# Altium project pay-optical.PrjPCB (part 2 of 2)
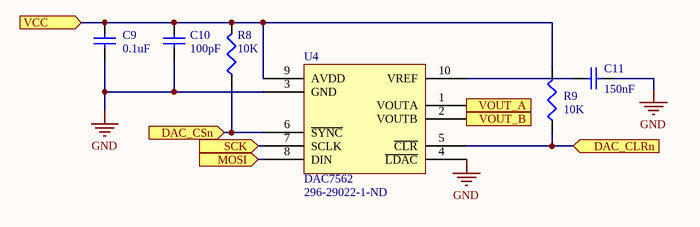
[diagram p13: dac-ic.SchDoc]

## Nets that join several sheets
3V: pay-optical-toplevel (C1.2 U1.1), analog-to-digital-stage (R2.2), adc-ic (7 pins), synchronous-demodulator (C13.2 R11.2 R12.2 U5.5), ADC/Synchronous Demodulator Circuit/CH1/TIA_Signal_Mux (C34_TIA_Signal_Mux1.2 C35_TIA_Signal_Mux1.2 R29_TIA_Signal_Mux1.2 U13_TIA_Signal_Mux1.16), ADC/Synchronous Demodulator Circuit/CH1/TIA1 (C27_TIA1.2 C28_TIA1.2 U10_TIA1.5), ADC/Synchronous Demodulator Circuit/CH1/TIA2 (C27_TIA2.2 C28_TIA2.2 U10_TIA2.5), ADC/Synchronous Demodulator Circuit/CH1/TIA3 (C27_TIA3.2 C28_TIA3.2 U10_TIA3.5), ADC/Synchronous Demodulator Circuit/CH1/TIA4 (C27_TIA4.2 C28_TIA4.2 U10_TIA4.5), ADC/Synchronous Demodulator Circuit/CH1/TIA5 (C27_TIA5.2 C28_TIA5.2 U10_TIA5.5), ADC/Synchronous Demodulator Circuit/CH1/TIA6 (C27_TIA6.2 C28_TIA6.2 U10_TIA6.5), ADC/Synchronous Demodulator Circuit/CH1/TIA7 (C27_TIA7.2 C28_TIA7.2 U10_TIA7.5), ADC/Synchronous Demodulator Circuit/CH1/TIA8 (C27_TIA8.2 C28_TIA8.2 U10_TIA8.5), ADC/Synchronous Demodulator Circuit/CH1/LED_Signal_Mux (C34_LED_Signal_Mux1.2 C35_LED_Signal_Mux1.2 R29_LED_Signal_Mux1.2 U13_LED_Signal_Mux1.16), ADC/Synchronous Demodulator Circuit/CH2/TIA_Signal_Mux (C34_TIA_Signal_Mux2.2 C35_TIA_Signal_Mux2.2 R29_TIA_Signal_Mux2.2 U13_TIA_Signal_Mux2.16), ADC/Synchronous Demodulator Circuit/CH2/TIA1 (C27_TIA9.2 C28_TIA9.2 U10_TIA9.5), ADC/Synchronous Demodulator Circuit/CH2/TIA2 (C27_TIA10.2 C28_TIA10.2 U10_TIA10.5), ADC/Synchronous Demodulator Circuit/CH2/TIA3 (C27_TIA11.2 C28_TIA11.2 U10_TIA11.5), ADC/Synchronous Demodulator Circuit/CH2/TIA4 (C27_TIA12.2 C28_TIA12.2 U10_TIA12.5), ADC/Synchronous Demodulator Circuit/CH2/TIA5 (C27_TIA13.2 C28_TIA13.2 U10_TIA13.5), ADC/Synchronous Demodulator Circuit/CH2/TIA6 (C27_TIA14.2 C28_TIA14.2 U10_TIA14.5), ADC/Synchronous Demodulator Circuit/CH2/TIA7 (C27_TIA15.2 C28_TIA15.2 U10_TIA15.5), ADC/Synchronous Demodulator Circuit/CH2/TIA8 (C27_TIA16.2 C28_TIA16.2 U10_TIA16.5), ADC/Synchronous Demodulator Circuit/CH2/LED_Signal_Mux (C34_LED_Signal_Mux2.2 C35_LED_Signal_Mux2.2 R29_LED_Signal_Mux2.2 U13_LED_Signal_Mux2.16), ADC/Synchronous Demodulator Circuit/CH3/TIA_Signal_Mux (C34_TIA_Signal_Mux3.2 C35_TIA_Signal_Mux3.2 R29_TIA_Signal_Mux3.2 U13_TIA_Signal_Mux3.16), ADC/Synchronous Demodulator Circuit/CH3/TIA1 (C27_TIA17.2 C28_TIA17.2 U10_TIA17.5), ADC/Synchronous Demodulator Circuit/CH3/TIA2 (C27_TIA18.2 C28_TIA18.2 U10_TIA18.5), ADC/Synchronous Demodulator Circuit/CH3/TIA3 (C27_TIA19.2 C28_TIA19.2 U10_TIA19.5), ADC/Synchronous Demodulator Circuit/CH3/TIA4 (C27_TIA20.2 C28_TIA20.2 U10_TIA20.5), ADC/Synchronous Demodulator Circuit/CH3/TIA5 (C27_TIA21.2 C28_TIA21.2 U10_TIA21.5), ADC/Synchronous Demodulator Circuit/CH3/TIA6 (C27_TIA22.2 C28_TIA22.2 U10_TIA22.5), ADC/Synchronous Demodulator Circuit/CH3/TIA7 (C27_TIA23.2 C28_TIA23.2 U10_TIA23.5), ADC/Synchronous Demodulator Circuit/CH3/TIA8 (C27_TIA24.2 C28_TIA24.2 U10_TIA24.5), ADC/Synchronous Demodulator Circuit/CH3/LED_Signal_Mux (C34_LED_Signal_Mux3.2 C35_LED_Signal_Mux3.2 R29_LED_Signal_Mux3.2 U13_LED_Signal_Mux3.16), ADC/Synchronous Demodulator Circuit/SD1 (9 pins), ADC/Synchronous Demodulator Circuit/SD2 (9 pins), ADC/Synchronous Demodulator Circuit/SD3 (9 pins), ADC/Synchronous Demodulator Circuit/SD4 (9 pins), ADC/Synchronous Demodulator Circuit/HP_FILTER1 (5 pins), ADC/Synchronous Demodulator Circuit/HP_FILTER2 (5 pins), ADC/Synchronous Demodulator Circuit/HP_FILTER3 (5 pins), ADC/Synchronous Demodulator Circuit/HP_FILTER4 (5 pins), ADC/Synchronous Demodulator Circuit/CH4/TIA_Signal_Mux (C34_TIA_Signal_Mux4.2 C35_TIA_Signal_Mux4.2 R29_TIA_Signal_Mux4.2 U13_TIA_Signal_Mux4.16), ADC/Synchronous Demodulator Circuit/CH4/TIA1 (C27_TIA25.2 C28_TIA25.2 U10_TIA25.5), ADC/Synchronous Demodulator Circuit/CH4/TIA2 (C27_TIA26.2 C28_TIA26.2 U10_TIA26.5), ADC/Synchronous Demodulator Circuit/CH4/TIA3 (C27_TIA27.2 C28_TIA27.2 U10_TIA27.5), ADC/Synchronous Demodulator Circuit/CH4/TIA4 (C27_TIA28.2 C28_TIA28.2 U10_TIA28.5), ADC/Synchronous Demodulator Circuit/CH4/TIA5 (C27_TIA29.2 C28_TIA29.2 U10_TIA29.5), ADC/Synchronous Demodulator Circuit/CH4/TIA6 (C27_TIA30.2 C28_TIA30.2 U10_TIA30.5), ADC/Synchronous Demodulator Circuit/CH4/TIA7 (C27_TIA31.2 C28_TIA31.2 U10_TIA31.5), ADC/Synchronous Demodulator Circuit/CH4/TIA8 (C27_TIA32.2 C28_TIA32.2 U10_TIA32.5), ADC/Synchronous Demodulator Circuit/CH4/LED_Signal_Mux (C34_LED_Signal_Mux4.2 C35_LED_Signal_Mux4.2 R29_LED_Signal_Mux4.2 U13_LED_Signal_Mux4.16), ADC/Synchronous Demodulator Circuit/CH5/TIA_Signal_Mux (C34_TIA_Signal_Mux5.2 C35_TIA_Signal_Mux5.2 R29_TIA_Signal_Mux5.2 U13_TIA_Signal_Mux5.16), ADC/Synchronous Demodulator Circuit/CH5/TIA_S1 (C27_TIA_S33.2 C28_TIA_S33.2 U10_TIA_S33.5), ADC/Synchronous Demodulator Circuit/CH5/TIA_S2 (C27_TIA_S34.2 C28_TIA_S34.2 U10_TIA_S34.5), ADC/Synchronous Demodulator Circuit/CH5/LED_Signal_Mux (C34_LED_Signal_Mux5.2 C35_LED_Signal_Mux5.2 R29_LED_Signal_Mux5.2 U13_LED_Signal_Mux5.16), sma-amplifier (6 pins), dac-ic (5 pins)
3V3: pay-optical-toplevel (5 pins), adc-ic (C3.2 R6.2 R7.2 U2.24)
AGND: adc-ic (13 pins), ADC/Synchronous Demodulator Circuit/CH1/TIA1 (6 pins), ADC/Synchronous Demodulator Circuit/CH1/TIA2 (6 pins), ADC/Synchronous Demodulator Circuit/CH1/TIA3 (6 pins), ADC/Synchronous Demodulator Circuit/CH1/TIA4 (6 pins), ADC/Synchronous Demodulator Circuit/CH1/TIA5 (6 pins), ADC/Synchronous Demodulator Circuit/CH1/TIA6 (6 pins), ADC/Synchronous Demodulator Circuit/CH1/TIA7 (6 pins), ADC/Synchronous Demodulator Circuit/CH1/TIA8 (6 pins), ADC/Synchronous Demodulator Circuit/CH2/TIA1 (6 pins), ADC/Synchronous Demodulator Circuit/CH2/TIA2 (6 pins), ADC/Synchronous Demodulator Circuit/CH2/TIA3 (6 pins), ADC/Synchronous Demodulator Circuit/CH2/TIA4 (6 pins), ADC/Synchronous Demodulator Circuit/CH2/TIA5 (6 pins), ADC/Synchronous Demodulator Circuit/CH2/TIA6 (6 pins), ADC/Synchronous Demodulator Circuit/CH2/TIA7 (6 pins), ADC/Synchronous Demodulator Circuit/CH2/TIA8 (6 pins), ADC/Synchronous Demodulator Circuit/CH3/TIA1 (6 pins), ADC/Synchronous Demodulator Circuit/CH3/TIA2 (6 pins), ADC/Synchronous Demodulator Circuit/CH3/TIA3 (6 pins), ADC/Synchronous Demodulator Circuit/CH3/TIA4 (6 pins), ADC/Synchronous Demodulator Circuit/CH3/TIA5 (6 pins), ADC/Synchronous Demodulator Circuit/CH3/TIA6 (6 pins), ADC/Synchronous Demodulator Circuit/CH3/TIA7 (6 pins), ADC/Synchronous Demodulator Circuit/CH3/TIA8 (6 pins), ADC/Synchronous Demodulator Circuit/CH4/TIA1 (6 pins), ADC/Synchronous Demodulator Circuit/CH4/TIA2 (6 pins), ADC/Synchronous Demodulator Circuit/CH4/TIA3 (6 pins), ADC/Synchronous Demodulator Circuit/CH4/TIA4 (6 pins), ADC/Synchronous Demodulator Circuit/CH4/TIA5 (6 pins), ADC/Synchronous Demodulator Circuit/CH4/TIA6 (6 pins), ADC/Synchronous Demodulator Circuit/CH4/TIA7 (6 pins), ADC/Synchronous Demodulator Circuit/CH4/TIA8 (6 pins), ADC/Synchronous Demodulator Circuit/CH5/TIA_S1 (6 pins), ADC/Synchronous Demodulator Circuit/CH5/TIA_S2 (6 pins)
GND: pay-optical-toplevel (8 pins), analog-to-digital-stage (R3.1 R4.1 R5.1), synchronous-demodulator (C13.1 U5.2), ADC/Synchronous Demodulator Circuit/CH1/TIA_Signal_Mux (C34_TIA_Signal_Mux1.1 C35_TIA_Signal_Mux1.1 U13_TIA_Signal_Mux1.7 U13_TIA_Signal_Mux1.8), ADC/Synchronous Demodulator Circuit/CH1/LED_Signal_Mux (C34_LED_Signal_Mux1.1 C35_LED_Signal_Mux1.1 U13_LED_Signal_Mux1.7 U13_LED_Signal_Mux1.8), ADC/Synchronous Demodulator Circuit/CH2/TIA_Signal_Mux (C34_TIA_Signal_Mux2.1 C35_TIA_Signal_Mux2.1 U13_TIA_Signal_Mux2.7 U13_TIA_Signal_Mux2.8), ADC/Synchronous Demodulator Circuit/CH2/LED_Signal_Mux (C34_LED_Signal_Mux2.1 C35_LED_Signal_Mux2.1 U13_LED_Signal_Mux2.7 U13_LED_Signal_Mux2.8), ADC/Synchronous Demodulator Circuit/CH3/TIA_Signal_Mux (C34_TIA_Signal_Mux3.1 C35_TIA_Signal_Mux3.1 U13_TIA_Signal_Mux3.7 U13_TIA_Signal_Mux3.8), ADC/Synchronous Demodulator Circuit/CH3/LED_Signal_Mux (C34_LED_Signal_Mux3.1 C35_LED_Signal_Mux3.1 U13_LED_Signal_Mux3.7 U13_LED_Signal_Mux3.8), ADC/Synchronous Demodulator Circuit/SD1 (9 pins), ADC/Synchronous Demodulator Circuit/SD2 (9 pins), ADC/Synchronous Demodulator Circuit/SD3 (9 pins), ADC/Synchronous Demodulator Circuit/SD4 (9 pins), ADC/Synchronous Demodulator Circuit/HP_FILTER1 (8 pins), ADC/Synchronous Demodulator Circuit/HP_FILTER2 (8 pins), ADC/Synchronous Demodulator Circuit/HP_FILTER3 (8 pins), ADC/Synchronous Demodulator Circuit/HP_FILTER4 (8 pins), ADC/Synchronous Demodulator Circuit/CH4/TIA_Signal_Mux (C34_TIA_Signal_Mux4.1 C35_TIA_Signal_Mux4.1 U13_TIA_Signal_Mux4.7 U13_TIA_Signal_Mux4.8), ADC/Synchronous Demodulator Circuit/CH4/LED_Signal_Mux (C34_LED_Signal_Mux4.1 C35_LED_Signal_Mux4.1 U13_LED_Signal_Mux4.7 U13_LED_Signal_Mux4.8), special-channel-selection (R20.1 R21.1), ADC/Synchronous Demodulator Circuit/CH5/TIA_Signal_Mux (C34_TIA_Signal_Mux5.1 C35_TIA_Signal_Mux5.1 U13_TIA_Signal_Mux5.7 U13_TIA_Signal_Mux5.8), ADC/Synchronous Demodulator Circuit/CH5/LED_Signal_Mux (C34_LED_Signal_Mux5.1 C35_LED_Signal_Mux5.1 U13_LED_Signal_Mux5.7 U13_LED_Signal_Mux5.8), sma-amplifier (17 pins), ADC/LPF_P1 (C12_LPF_P5.1), ADC/LPF_P2 (C12_LPF_P6.1), ADC/LPF_P3 (C12_LPF_P7.1), ADC/LPF_P4 (C12_LPF_P8.1), dac-ic (5 pins), ADC/LPF_N1 (C12_LPF_N1.1), ADC/LPF_N2 (C12_LPF_N2.1), ADC/LPF_N3 (C12_LPF_N3.1), ADC/LPF_N4 (C12_LPF_N4.1)
ADC_CSn: pay-optical-toplevel (P1.14), adc-ic (R6.1 U2.32)
ADC_SYNCn: pay-optical-toplevel (P1.16), adc-ic (R7.1 U2.25)
AIN1/P3: analog-to-digital-stage (R2.1), adc-ic (U2.1), synchronous-demodulator (U5.4), ADC/Synchronous Demodulator Circuit/CH1/TIA_Signal_Mux (R29_TIA_Signal_Mux1.1 U13_TIA_Signal_Mux1.6), ADC/Synchronous Demodulator Circuit/CH1/LED_Signal_Mux (R29_LED_Signal_Mux1.1 U13_LED_Signal_Mux1.6), ADC/Synchronous Demodulator Circuit/CH2/TIA_Signal_Mux (R29_TIA_Signal_Mux2.1 U13_TIA_Signal_Mux2.6), ADC/Synchronous Demodulator Circuit/CH2/LED_Signal_Mux (R29_LED_Signal_Mux2.1 U13_LED_Signal_Mux2.6), ADC/Synchronous Demodulator Circuit/CH3/TIA_Signal_Mux (R29_TIA_Signal_Mux3.1 U13_TIA_Signal_Mux3.6), ADC/Synchronous Demodulator Circuit/CH3/LED_Signal_Mux (R29_LED_Signal_Mux3.1 U13_LED_Signal_Mux3.6)
AIN2/P2: analog-to-digital-stage (R3.2), adc-ic (U2.2), ADC/Synchronous Demodulator Circuit/CH1/TIA_Signal_Mux (U13_TIA_Signal_Mux1.9), ADC/Synchronous Demodulator Circuit/CH1/LED_Signal_Mux (U13_LED_Signal_Mux1.9), ADC/Synchronous Demodulator Circuit/CH2/TIA_Signal_Mux (U13_TIA_Signal_Mux2.9), ADC/Synchronous Demodulator Circuit/CH2/LED_Signal_Mux (U13_LED_Signal_Mux2.9), ADC/Synchronous Demodulator Circuit/CH3/TIA_Signal_Mux (U13_TIA_Signal_Mux3.9), ADC/Synchronous Demodulator Circuit/CH3/LED_Signal_Mux (U13_LED_Signal_Mux3.9), ADC/Synchronous Demodulator Circuit/CH4/TIA_Signal_Mux (U13_TIA_Signal_Mux4.9), ADC/Synchronous Demodulator Circuit/CH4/LED_Signal_Mux (U13_LED_Signal_Mux4.9), ADC/Synchronous Demodulator Circuit/CH5/TIA_Signal_Mux (U13_TIA_Signal_Mux5.9), ADC/Synchronous Demodulator Circuit/CH5/LED_Signal_Mux (U13_LED_Signal_Mux5.9)
AIN3/P1: analog-to-digital-stage (R4.2), adc-ic (U2.3), ADC/Synchronous Demodulator Circuit/CH1/TIA_Signal_Mux (U13_TIA_Signal_Mux1.10), ADC/Synchronous Demodulator Circuit/CH1/LED_Signal_Mux (U13_LED_Signal_Mux1.10), ADC/Synchronous Demodulator Circuit/CH2/TIA_Signal_Mux (U13_TIA_Signal_Mux2.10), ADC/Synchronous Demodulator Circuit/CH2/LED_Signal_Mux (U13_LED_Signal_Mux2.10), ADC/Synchronous Demodulator Circuit/CH3/TIA_Signal_Mux (U13_TIA_Signal_Mux3.10), ADC/Synchronous Demodulator Circuit/CH3/LED_Signal_Mux (U13_LED_Signal_Mux3.10), ADC/Synchronous Demodulator Circuit/CH4/TIA_Signal_Mux (U13_TIA_Signal_Mux4.10), ADC/Synchronous Demodulator Circuit/CH4/LED_Signal_Mux (U13_LED_Signal_Mux4.10), ADC/Synchronous Demodulator Circuit/CH5/TIA_Signal_Mux (U13_TIA_Signal_Mux5.10), ADC/Synchronous Demodulator Circuit/CH5/LED_Signal_Mux (U13_LED_Signal_Mux5.10)
AIN4/P0: analog-to-digital-stage (R5.2), adc-ic (U2.4), ADC/Synchronous Demodulator Circuit/CH1/TIA_Signal_Mux (U13_TIA_Signal_Mux1.11), ADC/Synchronous Demodulator Circuit/CH1/LED_Signal_Mux (U13_LED_Signal_Mux1.11), ADC/Synchronous Demodulator Circuit/CH2/TIA_Signal_Mux (U13_TIA_Signal_Mux2.11), ADC/Synchronous Demodulator Circuit/CH2/LED_Signal_Mux (U13_LED_Signal_Mux2.11), ADC/Synchronous Demodulator Circuit/CH3/TIA_Signal_Mux (U13_TIA_Signal_Mux3.11), ADC/Synchronous Demodulator Circuit/CH3/LED_Signal_Mux (U13_LED_Signal_Mux3.11), ADC/Synchronous Demodulator Circuit/CH4/TIA_Signal_Mux (U13_TIA_Signal_Mux4.11), ADC/Synchronous Demodulator Circuit/CH4/LED_Signal_Mux (U13_LED_Signal_Mux4.11), ADC/Synchronous Demodulator Circuit/CH5/TIA_Signal_Mux (U13_TIA_Signal_Mux5.11), ADC/Synchronous Demodulator Circuit/CH5/LED_Signal_Mux (U13_LED_Signal_Mux5.11)
AIN15: adc-ic (U2.19), dac-ic (U4.1)
AIN16: adc-ic (U2.20), dac-ic (U4.2)
CH4_ENn: synchronous-demodulator (R11.1 U5.1), ADC/Synchronous Demodulator Circuit/CH4/TIA_Signal_Mux (R29_TIA_Signal_Mux4.1 U13_TIA_Signal_Mux4.6), ADC/Synchronous Demodulator Circuit/CH4/LED_Signal_Mux (R29_LED_Signal_Mux4.1 U13_LED_Signal_Mux4.6)
DAC_CSn: pay-optical-toplevel (P1.12), dac-ic (R8.1 U4.6)
FL_LED1_CH1: ADC/Synchronous Demodulator Circuit/CH1/TIA1 (R22_TIA1.1), ADC/Synchronous Demodulator Circuit/CH1/LED_Signal_Mux (U13_LED_Signal_Mux1.13)
FL_LED1_CH2: ADC/Synchronous Demodulator Circuit/CH2/TIA1 (R22_TIA9.1), ADC/Synchronous Demodulator Circuit/CH2/LED_Signal_Mux (U13_LED_Signal_Mux2.13)
FL_LED1_CH3: ADC/Synchronous Demodulator Circuit/CH3/TIA1 (R22_TIA17.1), ADC/Synchronous Demodulator Circuit/CH3/LED_Signal_Mux (U13_LED_Signal_Mux3.13)
FL_LED1_CH4: ADC/Synchronous Demodulator Circuit/CH4/TIA1 (R22_TIA25.1), ADC/Synchronous Demodulator Circuit/CH4/LED_Signal_Mux (U13_LED_Signal_Mux4.13)
FL_LED2_CH1: ADC/Synchronous Demodulator Circuit/CH1/TIA2 (R22_TIA2.1), ADC/Synchronous Demodulator Circuit/CH1/LED_Signal_Mux (U13_LED_Signal_Mux1.14)
FL_LED2_CH2: ADC/Synchronous Demodulator Circuit/CH2/TIA2 (R22_TIA10.1), ADC/Synchronous Demodulator Circuit/CH2/LED_Signal_Mux (U13_LED_Signal_Mux2.14)
FL_LED2_CH3: ADC/Synchronous Demodulator Circuit/CH3/TIA2 (R22_TIA18.1), ADC/Synchronous Demodulator Circuit/CH3/LED_Signal_Mux (U13_LED_Signal_Mux3.14)
FL_LED2_CH4: ADC/Synchronous Demodulator Circuit/CH4/TIA2 (R22_TIA26.1), ADC/Synchronous Demodulator Circuit/CH4/LED_Signal_Mux (U13_LED_Signal_Mux4.14)
FL_LED3_CH1: ADC/Synchronous Demodulator Circuit/CH1/TIA3 (R22_TIA3.1), ADC/Synchronous Demodulator Circuit/CH1/LED_Signal_Mux (U13_LED_Signal_Mux1.15)
FL_LED3_CH2: ADC/Synchronous Demodulator Circuit/CH2/TIA3 (R22_TIA11.1), ADC/Synchronous Demodulator Circuit/CH2/LED_Signal_Mux (U13_LED_Signal_Mux2.15)
FL_LED3_CH3: ADC/Synchronous Demodulator Circuit/CH3/TIA3 (R22_TIA19.1), ADC/Synchronous Demodulator Circuit/CH3/LED_Signal_Mux (U13_LED_Signal_Mux3.15)
FL_LED3_CH4: ADC/Synchronous Demodulator Circuit/CH4/TIA3 (R22_TIA27.1), ADC/Synchronous Demodulator Circuit/CH4/LED_Signal_Mux (U13_LED_Signal_Mux4.15)
FL_LED4_CH1: ADC/Synchronous Demodulator Circuit/CH1/TIA4 (R22_TIA4.1), ADC/Synchronous Demodulator Circuit/CH1/LED_Signal_Mux (U13_LED_Signal_Mux1.12)
FL_LED4_CH2: ADC/Synchronous Demodulator Circuit/CH2/TIA4 (R22_TIA12.1), ADC/Synchronous Demodulator Circuit/CH2/LED_Signal_Mux (U13_LED_Signal_Mux2.12)
FL_LED4_CH3: ADC/Synchronous Demodulator Circuit/CH3/TIA4 (R22_TIA20.1), ADC/Synchronous Demodulator Circuit/CH3/LED_Signal_Mux (U13_LED_Signal_Mux3.12)
FL_LED4_CH4: ADC/Synchronous Demodulator Circuit/CH4/TIA4 (R22_TIA28.1), ADC/Synchronous Demodulator Circuit/CH4/LED_Signal_Mux (U13_LED_Signal_Mux4.12)
FL_LED5_CH1: ADC/Synchronous Demodulator Circuit/CH1/TIA5 (R22_TIA5.1), ADC/Synchronous Demodulator Circuit/CH1/LED_Signal_Mux (U13_LED_Signal_Mux1.1)
FL_LED5_CH2: ADC/Synchronous Demodulator Circuit/CH2/TIA5 (R22_TIA13.1), ADC/Synchronous Demodulator Circuit/CH2/LED_Signal_Mux (U13_LED_Signal_Mux2.1)
FL_LED5_CH3: ADC/Synchronous Demodulator Circuit/CH3/TIA5 (R22_TIA21.1), ADC/Synchronous Demodulator Circuit/CH3/LED_Signal_Mux (U13_LED_Signal_Mux3.1)
FL_LED5_CH4: ADC/Synchronous Demodulator Circuit/CH4/TIA5 (R22_TIA29.1), ADC/Synchronous Demodulator Circuit/CH4/LED_Signal_Mux (U13_LED_Signal_Mux4.1)
FL_LED6_CH1: ADC/Synchronous Demodulator Circuit/CH1/TIA6 (R22_TIA6.1), ADC/Synchronous Demodulator Circuit/CH1/LED_Signal_Mux (U13_LED_Signal_Mux1.5)
FL_LED6_CH2: ADC/Synchronous Demodulator Circuit/CH2/TIA6 (R22_TIA14.1), ADC/Synchronous Demodulator Circuit/CH2/LED_Signal_Mux (U13_LED_Signal_Mux2.5)
FL_LED6_CH3: ADC/Synchronous Demodulator Circuit/CH3/TIA6 (R22_TIA22.1), ADC/Synchronous Demodulator Circuit/CH3/LED_Signal_Mux (U13_LED_Signal_Mux3.5)
FL_LED6_CH4: ADC/Synchronous Demodulator Circuit/CH4/TIA6 (R22_TIA30.1), ADC/Synchronous Demodulator Circuit/CH4/LED_Signal_Mux (U13_LED_Signal_Mux4.5)
FL_LED7_CH1: ADC/Synchronous Demodulator Circuit/CH1/TIA7 (R22_TIA7.1), ADC/Synchronous Demodulator Circuit/CH1/LED_Signal_Mux (U13_LED_Signal_Mux1.2)
FL_LED7_CH2: ADC/Synchronous Demodulator Circuit/CH2/TIA7 (R22_TIA15.1), ADC/Synchronous Demodulator Circuit/CH2/LED_Signal_Mux (U13_LED_Signal_Mux2.2)
FL_LED7_CH3: ADC/Synchronous Demodulator Circuit/CH3/TIA7 (R22_TIA23.1), ADC/Synchronous Demodulator Circuit/CH3/LED_Signal_Mux (U13_LED_Signal_Mux3.2)
FL_LED7_CH4: ADC/Synchronous Demodulator Circuit/CH4/TIA7 (R22_TIA31.1), ADC/Synchronous Demodulator Circuit/CH4/LED_Signal_Mux (U13_LED_Signal_Mux4.2)
FL_LED8_CH1: ADC/Synchronous Demodulator Circuit/CH1/TIA8 (R22_TIA8.1), ADC/Synchronous Demodulator Circuit/CH1/LED_Signal_Mux (U13_LED_Signal_Mux1.4)
FL_LED8_CH2: ADC/Synchronous Demodulator Circuit/CH2/TIA8 (R22_TIA16.1), ADC/Synchronous Demodulator Circuit/CH2/LED_Signal_Mux (U13_LED_Signal_Mux2.4)
FL_LED8_CH3: ADC/Synchronous Demodulator Circuit/CH3/TIA8 (R22_TIA24.1), ADC/Synchronous Demodulator Circuit/CH3/LED_Signal_Mux (U13_LED_Signal_Mux3.4)
FL_LED8_CH4: ADC/Synchronous Demodulator Circuit/CH4/TIA8 (R22_TIA32.1), ADC/Synchronous Demodulator Circuit/CH4/LED_Signal_Mux (U13_LED_Signal_Mux4.4)
LED_Sig1: ADC/Synchronous Demodulator Circuit/CH1/LED_Signal_Mux (U13_LED_Signal_Mux1.3), ADC/Synchronous Demodulator Circuit/SD1 (U6_SD1.1 U6_SD1.4)
LED_Sig2: ADC/Synchronous Demodulator Circuit/CH2/LED_Signal_Mux (U13_LED_Signal_Mux2.3), ADC/Synchronous Demodulator Circuit/SD2 (U6_SD2.1 U6_SD2.4)
LED_Sig3: ADC/Synchronous Demodulator Circuit/CH3/LED_Signal_Mux (U13_LED_Signal_Mux3.3), ADC/Synchronous Demodulator Circuit/SD3 (U6_SD3.1 U6_SD3.4)
LED_Sig4: ADC/Synchronous Demodulator Circuit/SD4 (U6_SD4.1 U6_SD4.4), ADC/Synchronous Demodulator Circuit/CH4/LED_Signal_Mux (U13_LED_Signal_Mux4.3), ADC/Synchronous Demodulator Circuit/CH5/LED_Signal_Mux (U13_LED_Signal_Mux5.3)
LPF_N1: adc-ic (U2.8), ADC/LPF_N1 (C12_LPF_N1.2 R10_LPF_N1.2)
LPF_N2: adc-ic (U2.10), ADC/LPF_N2 (C12_LPF_N2.2 R10_LPF_N2.2)
LPF_N3: adc-ic (U2.12), ADC/LPF_N3 (C12_LPF_N3.2 R10_LPF_N3.2)
LPF_N4: adc-ic (U2.14), ADC/LPF_N4 (C12_LPF_N4.2 R10_LPF_N4.2)
LPF_P1: adc-ic (U2.7), ADC/LPF_P1 (C12_LPF_P5.2 R10_LPF_P5.2)
LPF_P2: adc-ic (U2.9), ADC/LPF_P2 (C12_LPF_P6.2 R10_LPF_P6.2)
LPF_P3: adc-ic (U2.11), ADC/LPF_P3 (C12_LPF_P7.2 R10_LPF_P7.2)
LPF_P4: adc-ic (U2.13), ADC/LPF_P4 (C12_LPF_P8.2 R10_LPF_P8.2)
MISO: pay-optical-toplevel (P1.4), adc-ic (U2.27)
MOSI: pay-optical-toplevel (P1.6), adc-ic (U2.28), ADC/Synchronous Demodulator Circuit/SD1 (U7_SD1.14), ADC/Synchronous Demodulator Circuit/SD2 (U7_SD2.14), ADC/Synchronous Demodulator Circuit/SD3 (U7_SD3.14), ADC/Synchronous Demodulator Circuit/SD4 (U7_SD4.14), dac-ic (U4.8)
MUX_5_EN: pay-optical-toplevel (P1.10), synchronous-demodulator (R12.1 U5.3), ADC/Synchronous Demodulator Circuit/CH5/TIA_Signal_Mux (R29_TIA_Signal_Mux5.1 U13_TIA_Signal_Mux5.6), ADC/Synchronous Demodulator Circuit/CH5/LED_Signal_Mux (R29_LED_Signal_Mux5.1 U13_LED_Signal_Mux5.6)
REFSigO1: ADC/Synchronous Demodulator Circuit/SD1 (C20_SD1.2 U7_SD1.7 U7_SD1.8), ADC/Synchronous Demodulator Circuit/HP_FILTER1 (U8_HP_FILTER1.3)
REFSigO2: ADC/Synchronous Demodulator Circuit/SD2 (C20_SD2.2 U7_SD2.7 U7_SD2.8), ADC/Synchronous Demodulator Circuit/HP_FILTER2 (U8_HP_FILTER2.3)
REFSigO3: ADC/Synchronous Demodulator Circuit/SD3 (C20_SD3.2 U7_SD3.7 U7_SD3.8), ADC/Synchronous Demodulator Circuit/HP_FILTER3 (U8_HP_FILTER3.3)
REFSigO4: ADC/Synchronous Demodulator Circuit/SD4 (C20_SD4.2 U7_SD4.7 U7_SD4.8), ADC/Synchronous Demodulator Circuit/HP_FILTER4 (U8_HP_FILTER4.3)
S3: special-channel-selection (R21.2), ADC/Synchronous Demodulator Circuit/CH5/TIA_Signal_Mux (6 pins)
S3: ADC/Synchronous Demodulator Circuit/CH5/LED_Signal_Mux (U13_LED_Signal_Mux5.15), sma-amplifier (U11.1 U11.4)
S4: ADC/Synchronous Demodulator Circuit/CH5/LED_Signal_Mux (U13_LED_Signal_Mux5.12), sma-amplifier (C29.1 R25.2 U12.1)
S5: special-channel-selection (R20.2), ADC/Synchronous Demodulator Circuit/CH5/LED_Signal_Mux (U13_LED_Signal_Mux5.1 U13_LED_Signal_Mux5.2 U13_LED_Signal_Mux5.4 U13_LED_Signal_Mux5.5)
S_FL_LED1: ADC/Synchronous Demodulator Circuit/CH5/TIA_S1 (R22_TIA_S33.1), ADC/Synchronous Demodulator Circuit/CH5/LED_Signal_Mux (U13_LED_Signal_Mux5.13)
S_FL_LED2: ADC/Synchronous Demodulator Circuit/CH5/TIA_S2 (R22_TIA_S34.1), ADC/Synchronous Demodulator Circuit/CH5/LED_Signal_Mux (U13_LED_Signal_Mux5.14)
S_TIA1: ADC/Synchronous Demodulator Circuit/CH5/TIA_Signal_Mux (U13_TIA_Signal_Mux5.13), ADC/Synchronous Demodulator Circuit/CH5/TIA_S1 (C26_TIA_S33.2 R23_TIA_S33.2 U10_TIA_S33.1)
S_TIA2: ADC/Synchronous Demodulator Circuit/CH5/TIA_Signal_Mux (U13_TIA_Signal_Mux5.14), ADC/Synchronous Demodulator Circuit/CH5/TIA_S2 (C26_TIA_S34.2 R23_TIA_S34.2 U10_TIA_S34.1)
SCK: pay-optical-toplevel (P1.8), adc-ic (U2.31), ADC/Synchronous Demodulator Circuit/SD1 (U7_SD1.15), ADC/Synchronous Demodulator Circuit/SD2 (U7_SD2.15), ADC/Synchronous Demodulator Circuit/SD3 (U7_SD3.15), ADC/Synchronous Demodulator Circuit/SD4 (U7_SD4.15), dac-ic (U4.7)
SD_CLKIN: pay-optical-toplevel (P1.18), ADC/Synchronous Demodulator Circuit/SD1 (R13_SD1.2), ADC/Synchronous Demodulator Circuit/SD2 (R13_SD2.2), ADC/Synchronous Demodulator Circuit/SD3 (R13_SD3.2), ADC/Synchronous Demodulator Circuit/SD4 (R13_SD4.2)
SD_CSn1: pay-optical-toplevel (P1.9), ADC/Synchronous Demodulator Circuit/SD1 (R14_SD1.2 U7_SD1.3)
SD_CSn2: pay-optical-toplevel (P1.7), ADC/Synchronous Demodulator Circuit/SD2 (R14_SD2.2 U7_SD2.3)
SD_CSn3: pay-optical-toplevel (P1.5), ADC/Synchronous Demodulator Circuit/SD3 (R14_SD3.2 U7_SD3.3)
SD_CSn4: pay-optical-toplevel (P1.3), ADC/Synchronous Demodulator Circuit/SD4 (R14_SD4.2 U7_SD4.3)
SDOutN1: ADC/Synchronous Demodulator Circuit/SD1 (U7_SD1.10), ADC/LPF_N1 (R10_LPF_N1.1)
SDOutN2: ADC/Synchronous Demodulator Circuit/SD2 (U7_SD2.10), ADC/LPF_N2 (R10_LPF_N2.1)
SDOutN3: ADC/Synchronous Demodulator Circuit/SD3 (U7_SD3.10), ADC/LPF_N3 (R10_LPF_N3.1)
SDOutN4: ADC/Synchronous Demodulator Circuit/SD4 (U7_SD4.10), ADC/LPF_N4 (R10_LPF_N4.1)
SDOutP1: ADC/Synchronous Demodulator Circuit/SD1 (U7_SD1.11), ADC/LPF_P1 (R10_LPF_P5.1)
SDOutP2: ADC/Synchronous Demodulator Circuit/SD2 (U7_SD2.11), ADC/LPF_P2 (R10_LPF_P6.1)
SDOutP3: ADC/Synchronous Demodulator Circuit/SD3 (U7_SD3.11), ADC/LPF_P3 (R10_LPF_P7.1)
SDOutP4: ADC/Synchronous Demodulator Circuit/SD4 (U7_SD4.11), ADC/LPF_P4 (R10_LPF_P8.1)
SDSigIn1: ADC/Synchronous Demodulator Circuit/SD1 (U7_SD1.6), ADC/Synchronous Demodulator Circuit/HP_FILTER1 (C25_HP_FILTER1.2 R19_HP_FILTER1.2)
SDSigIn2: ADC/Synchronous Demodulator Circuit/SD2 (U7_SD2.6), ADC/Synchronous Demodulator Circuit/HP_FILTER2 (C25_HP_FILTER2.2 R19_HP_FILTER2.2)
SDSigIn3: ADC/Synchronous Demodulator Circuit/SD3 (U7_SD3.6), ADC/Synchronous Demodulator Circuit/HP_FILTER3 (C25_HP_FILTER3.2 R19_HP_FILTER3.2)
SDSigIn4: ADC/Synchronous Demodulator Circuit/SD4 (U7_SD4.6), ADC/Synchronous Demodulator Circuit/HP_FILTER4 (C25_HP_FILTER4.2 R19_HP_FILTER4.2)
SYNCO1: pay-optical-toplevel (P1.17), ADC/Synchronous Demodulator Circuit/SD1 (U7_SD1.2)
SYNCO2: pay-optical-toplevel (P1.15), ADC/Synchronous Demodulator Circuit/SD2 (U7_SD2.2)
SYNCO3: pay-optical-toplevel (P1.13), ADC/Synchronous Demodulator Circuit/SD3 (U7_SD3.2)
SYNCO4: pay-optical-toplevel (P1.11), ADC/Synchronous Demodulator Circuit/SD4 (U7_SD4.2)
TIA1_CH1: ADC/Synchronous Demodulator Circuit/CH1/TIA_Signal_Mux (U13_TIA_Signal_Mux1.13), ADC/Synchronous Demodulator Circuit/CH1/TIA1 (C26_TIA1.2 R23_TIA1.2 U10_TIA1.1)
TIA1_CH2: ADC/Synchronous Demodulator Circuit/CH2/TIA_Signal_Mux (U13_TIA_Signal_Mux2.13), ADC/Synchronous Demodulator Circuit/CH2/TIA1 (C26_TIA9.2 R23_TIA9.2 U10_TIA9.1)
TIA1_CH3: ADC/Synchronous Demodulator Circuit/CH3/TIA_Signal_Mux (U13_TIA_Signal_Mux3.13), ADC/Synchronous Demodulator Circuit/CH3/TIA1 (C26_TIA17.2 R23_TIA17.2 U10_TIA17.1)
TIA1_CH4: ADC/Synchronous Demodulator Circuit/CH4/TIA_Signal_Mux (U13_TIA_Signal_Mux4.13), ADC/Synchronous Demodulator Circuit/CH4/TIA1 (C26_TIA25.2 R23_TIA25.2 U10_TIA25.1)
TIA2_CH1: ADC/Synchronous Demodulator Circuit/CH1/TIA_Signal_Mux (U13_TIA_Signal_Mux1.14), ADC/Synchronous Demodulator Circuit/CH1/TIA2 (C26_TIA2.2 R23_TIA2.2 U10_TIA2.1)
TIA2_CH2: ADC/Synchronous Demodulator Circuit/CH2/TIA_Signal_Mux (U13_TIA_Signal_Mux2.14), ADC/Synchronous Demodulator Circuit/CH2/TIA2 (C26_TIA10.2 R23_TIA10.2 U10_TIA10.1)
TIA2_CH3: ADC/Synchronous Demodulator Circuit/CH3/TIA_Signal_Mux (U13_TIA_Signal_Mux3.14), ADC/Synchronous Demodulator Circuit/CH3/TIA2 (C26_TIA18.2 R23_TIA18.2 U10_TIA18.1)
TIA2_CH4: ADC/Synchronous Demodulator Circuit/CH4/TIA_Signal_Mux (U13_TIA_Signal_Mux4.14), ADC/Synchronous Demodulator Circuit/CH4/TIA2 (C26_TIA26.2 R23_TIA26.2 U10_TIA26.1)
TIA3_CH1: ADC/Synchronous Demodulator Circuit/CH1/TIA_Signal_Mux (U13_TIA_Signal_Mux1.15), ADC/Synchronous Demodulator Circuit/CH1/TIA3 (C26_TIA3.2 R23_TIA3.2 U10_TIA3.1)
TIA3_CH2: ADC/Synchronous Demodulator Circuit/CH2/TIA_Signal_Mux (U13_TIA_Signal_Mux2.15), ADC/Synchronous Demodulator Circuit/CH2/TIA3 (C26_TIA11.2 R23_TIA11.2 U10_TIA11.1)
TIA3_CH3: ADC/Synchronous Demodulator Circuit/CH3/TIA_Signal_Mux (U13_TIA_Signal_Mux3.15), ADC/Synchronous Demodulator Circuit/CH3/TIA3 (C26_TIA19.2 R23_TIA19.2 U10_TIA19.1)
TIA3_CH4: ADC/Synchronous Demodulator Circuit/CH4/TIA_Signal_Mux (U13_TIA_Signal_Mux4.15), ADC/Synchronous Demodulator Circuit/CH4/TIA3 (C26_TIA27.2 R23_TIA27.2 U10_TIA27.1)
TIA4_CH1: ADC/Synchronous Demodulator Circuit/CH1/TIA_Signal_Mux (U13_TIA_Signal_Mux1.12), ADC/Synchronous Demodulator Circuit/CH1/TIA4 (C26_TIA4.2 R23_TIA4.2 U10_TIA4.1)
TIA4_CH2: ADC/Synchronous Demodulator Circuit/CH2/TIA_Signal_Mux (U13_TIA_Signal_Mux2.12), ADC/Synchronous Demodulator Circuit/CH2/TIA4 (C26_TIA12.2 R23_TIA12.2 U10_TIA12.1)
TIA4_CH3: ADC/Synchronous Demodulator Circuit/CH3/TIA_Signal_Mux (U13_TIA_Signal_Mux3.12), ADC/Synchronous Demodulator Circuit/CH3/TIA4 (C26_TIA20.2 R23_TIA20.2 U10_TIA20.1)
TIA4_CH4: ADC/Synchronous Demodulator Circuit/CH4/TIA_Signal_Mux (U13_TIA_Signal_Mux4.12), ADC/Synchronous Demodulator Circuit/CH4/TIA4 (C26_TIA28.2 R23_TIA28.2 U10_TIA28.1)
TIA5_CH1: ADC/Synchronous Demodulator Circuit/CH1/TIA_Signal_Mux (U13_TIA_Signal_Mux1.1), ADC/Synchronous Demodulator Circuit/CH1/TIA5 (C26_TIA5.2 R23_TIA5.2 U10_TIA5.1)
TIA5_CH2: ADC/Synchronous Demodulator Circuit/CH2/TIA_Signal_Mux (U13_TIA_Signal_Mux2.1), ADC/Synchronous Demodulator Circuit/CH2/TIA5 (C26_TIA13.2 R23_TIA13.2 U10_TIA13.1)
TIA5_CH3: ADC/Synchronous Demodulator Circuit/CH3/TIA_Signal_Mux (U13_TIA_Signal_Mux3.1), ADC/Synchronous Demodulator Circuit/CH3/TIA5 (C26_TIA21.2 R23_TIA21.2 U10_TIA21.1)
TIA5_CH4: ADC/Synchronous Demodulator Circuit/CH4/TIA_Signal_Mux (U13_TIA_Signal_Mux4.1), ADC/Synchronous Demodulator Circuit/CH4/TIA5 (C26_TIA29.2 R23_TIA29.2 U10_TIA29.1)
TIA6_CH1: ADC/Synchronous Demodulator Circuit/CH1/TIA_Signal_Mux (U13_TIA_Signal_Mux1.5), ADC/Synchronous Demodulator Circuit/CH1/TIA6 (C26_TIA6.2 R23_TIA6.2 U10_TIA6.1)
TIA6_CH2: ADC/Synchronous Demodulator Circuit/CH2/TIA_Signal_Mux (U13_TIA_Signal_Mux2.5), ADC/Synchronous Demodulator Circuit/CH2/TIA6 (C26_TIA14.2 R23_TIA14.2 U10_TIA14.1)
TIA6_CH3: ADC/Synchronous Demodulator Circuit/CH3/TIA_Signal_Mux (U13_TIA_Signal_Mux3.5), ADC/Synchronous Demodulator Circuit/CH3/TIA6 (C26_TIA22.2 R23_TIA22.2 U10_TIA22.1)
TIA6_CH4: ADC/Synchronous Demodulator Circuit/CH4/TIA_Signal_Mux (U13_TIA_Signal_Mux4.5), ADC/Synchronous Demodulator Circuit/CH4/TIA6 (C26_TIA30.2 R23_TIA30.2 U10_TIA30.1)
TIA7_CH1: ADC/Synchronous Demodulator Circuit/CH1/TIA_Signal_Mux (U13_TIA_Signal_Mux1.2), ADC/Synchronous Demodulator Circuit/CH1/TIA7 (C26_TIA7.2 R23_TIA7.2 U10_TIA7.1)
TIA7_CH2: ADC/Synchronous Demodulator Circuit/CH2/TIA_Signal_Mux (U13_TIA_Signal_Mux2.2), ADC/Synchronous Demodulator Circuit/CH2/TIA7 (C26_TIA15.2 R23_TIA15.2 U10_TIA15.1)
TIA7_CH3: ADC/Synchronous Demodulator Circuit/CH3/TIA_Signal_Mux (U13_TIA_Signal_Mux3.2), ADC/Synchronous Demodulator Circuit/CH3/TIA7 (C26_TIA23.2 R23_TIA23.2 U10_TIA23.1)
TIA7_CH4: ADC/Synchronous Demodulator Circuit/CH4/TIA_Signal_Mux (U13_TIA_Signal_Mux4.2), ADC/Synchronous Demodulator Circuit/CH4/TIA7 (C26_TIA31.2 R23_TIA31.2 U10_TIA31.1)
TIA8_CH1: ADC/Synchronous Demodulator Circuit/CH1/TIA_Signal_Mux (U13_TIA_Signal_Mux1.4), ADC/Synchronous Demodulator Circuit/CH1/TIA8 (C26_TIA8.2 R23_TIA8.2 U10_TIA8.1)
TIA8_CH2: ADC/Synchronous Demodulator Circuit/CH2/TIA_Signal_Mux (U13_TIA_Signal_Mux2.4), ADC/Synchronous Demodulator Circuit/CH2/TIA8 (C26_TIA16.2 R23_TIA16.2 U10_TIA16.1)
TIA8_CH3: ADC/Synchronous Demodulator Circuit/CH3/TIA_Signal_Mux (U13_TIA_Signal_Mux3.4), ADC/Synchronous Demodulator Circuit/CH3/TIA8 (C26_TIA24.2 R23_TIA24.2 U10_TIA24.1)
TIA8_CH4: ADC/Synchronous Demodulator Circuit/CH4/TIA_Signal_Mux (U13_TIA_Signal_Mux4.4), ADC/Synchronous Demodulator Circuit/CH4/TIA8 (C26_TIA32.2 R23_TIA32.2 U10_TIA32.1)
TIASigOut1: ADC/Synchronous Demodulator Circuit/CH1/TIA_Signal_Mux (U13_TIA_Signal_Mux1.3), ADC/Synchronous Demodulator Circuit/HP_FILTER1 (C21_HP_FILTER1.2)
TIASigOut2: ADC/Synchronous Demodulator Circuit/CH2/TIA_Signal_Mux (U13_TIA_Signal_Mux2.3), ADC/Synchronous Demodulator Circuit/HP_FILTER2 (C21_HP_FILTER2.2)
TIASigOut3: ADC/Synchronous Demodulator Circuit/CH3/TIA_Signal_Mux (U13_TIA_Signal_Mux3.3), ADC/Synchronous Demodulator Circuit/HP_FILTER3 (C21_HP_FILTER3.2)
TIASigOut4: ADC/Synchronous Demodulator Circuit/HP_FILTER4 (C21_HP_FILTER4.2), ADC/Synchronous Demodulator Circuit/CH4/TIA_Signal_Mux (U13_TIA_Signal_Mux4.3), ADC/Synchronous Demodulator Circuit/CH5/TIA_Signal_Mux (U13_TIA_Signal_Mux5.3)